# Altium schematic sheet USBULPI.SchDoc
size A4; SheetNumber: 5; SheetTotal: 10
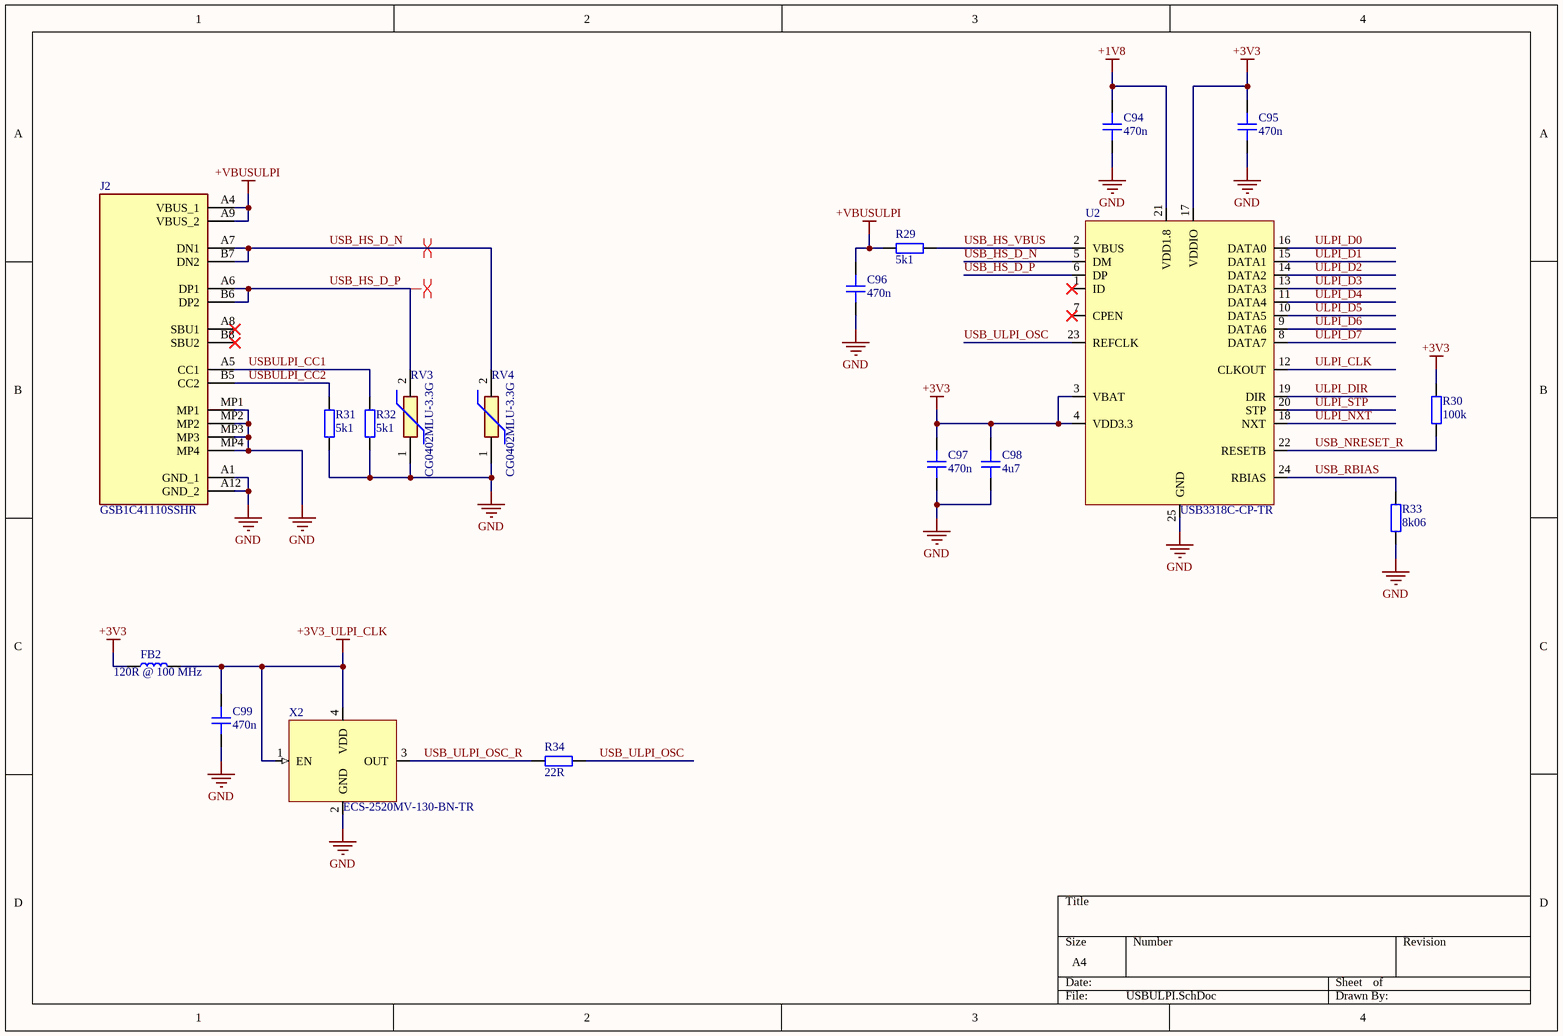
[diagram p0: USBULPI.SchDoc]

## Parts
C94  470n  [CAP_0201]
C95  470n  [CAP_0201]
C96  470n  [CAP_0201]
C97  470n  [CAP_0201]
C98  4u7  [CAP_0402]
C99  470n  [CAP_0201]
FB2  120R @ 100 MHz  [IND_0201]
J2  GSB1C41110SSHR  [GSB1C41110SSHR]
R29  5k1  [RES_0402]
R30  100k  [RES_0402]
R31  5k1  [RES_0402]
R32  5k1  [RES_0402]
R33  8k06  [RES_0402]
R34  22R  [RES_0201]
RV3  CG0402MLU-3.3G  [VARC1005X41N]
RV4  CG0402MLU-3.3G  [VARC1005X41N]
U2  USB3318C-CP-TR  [QFN50P400X400X100-25N-D]
X2  ECS-2520MV-130-BN-TR  [XTAL_2520]

## Nets
+1V8: C94.2 U2.21(VDD1.8)
+3V3: C95.2 C97.2 C98.2 FB2.1 R30.2 U2.3(VBAT) U2.4(VDD3.3) U2.17(VDDIO)
+3V3_ULPI_CLK: C99.2 FB2.2 X2.1(EN) X2.4(VDD)
+VBUSULPI: C96.2 J2.A4(VBUS_1) J2.A9(VBUS_2) R29.2
GND: C94.1 C95.1 C96.1 C97.1 C98.1 C99.1 J2.A1(GND_1) J2.A12(GND_2) J2.MP1 J2.MP2 J2.MP3 J2.MP4 R31.1 R32.1 R33.1 RV3.1 RV4.1 U2.25(GND) X2.2(GND)
ULPI_CLK: U2.12(CLKOUT)
ULPI_D0: U2.16(DATA0)
ULPI_D1: U2.15(DATA1)
ULPI_D2: U2.14(DATA2)
ULPI_D3: U2.13(DATA3)
ULPI_D4: U2.11(DATA4)
ULPI_D5: U2.10(DATA5)
ULPI_D6: U2.9(DATA6)
ULPI_D7: U2.8(DATA7)
ULPI_DIR: U2.19(DIR)
ULPI_NXT: U2.18(NXT)
ULPI_STP: U2.20(STP)
USB_HS_D_N: J2.A7(DN1) J2.B7(DN2) RV4.2 U2.5(DM)
USB_HS_D_P: J2.A6(DP1) J2.B6(DP2) RV3.2 U2.6(DP)
USB_HS_VBUS: R29.1 U2.2(VBUS)
USB_NRESET_R: R30.1 U2.22(RESETB)
USB_RBIAS: R33.2 U2.24(RBIAS)
USB_ULPI_OSC: R34.2 U2.23(REFCLK)
USB_ULPI_OSC_R: R34.1 X2.3(OUT)
USBULPI_CC1: J2.A5(CC1) R32.2
USBULPI_CC2: J2.B5(CC2) R31.2

Not connected (* = marked no-connect by the designer): J2 A8(SBU1)* B8(SBU2)*; U2 1(ID)* 7(CPEN)*

## Layout directives
differential pair: USB_HS_D_N, USB_HS_D_P

## Library data of the parts
C94-C97 C99 = CAP_0201: Capacitor SMD 0201; Manufacturer: *; Manufacturer Part Number: *; Distributor Link: *; LCSC: *; Rating: *; Dielectric: *
C98 = CAP_0402: Capacitor SMD 0402; Manufacturer: *; Manufacturer Part Number: *; Distributor Link: *; LCSC: *; Rating: *; Dielectric: *
FB2 = IND_0201: Inductor SMD 0201; Manufacturer_Name: Murata Electronics; Manufacturer_Part_Number: LQP03HQ56NH02D; Datasheet Link: https://psearch.en.murata.com/inductor/product/LQP03HQ56NH02%23.html; Height: 0.42mm; Mouser Part Number: 81-LQP03HQ56NH02D; Mouser Price/Stock: https://www.mouser.co.uk/ProductDetail/Murata-Electronics/LQP03HQ56NH02D?qs=B6kkDfuK7%2FBQu1Ob9%2FT2Bg%3D%3D
J2 = GSB1C41110SSHR: Connector; Manufacturer_Name: Amphenol Communications Solutions; Datasheet Link: https://cdn.amphenol-cs.com/media/wysiwyg/files/drawing/gsb1c41x10sshr-ax1.pdf; Height: 3.41mm; Manufacturer_Part_Number: GSB1C41110SSHR
R29-R33 = RES_0402: Resistor SMD 0402; Manufacturer: *; Manufacturer Part Number: *; Distributor Link: *; LCSC: *
R34 = RES_0201: Resistor SMD 0201; Manufacturer: *; Manufacturer Part Number: *; Distributor Link: *; LCSC: *
RV3 RV4 = CG0402MLU-3.3G: ESD Diode; Manufacturer_Name: Bourns; Datasheet Link: https://www.bourns.com/docs/Product-Datasheets/MLU.pdf; Height: 0.41mm; Manufacturer_Part_Number: CG0402MLU-3.3G; Mouser Part Number: 652-CG0402MLU-3.3G; Mouser Price/Stock: https://www.mouser.co.uk/ProductDetail/Bourns/CG0402MLU-3.3G?qs=m8myXnDJXpWVM8EQWErxtQ%3D%3D; Arrow Part Number: CG0402MLU-3.3G; Arrow Price/Stock: https://www.arrow.com/en/products/cg0402mlu-3.3g/bourns?utm_currency=USD&region=nac
U2 = USB3318C-CP-TR: USB Interface IC High Speed USB 1.8V ULPI; Manufacturer: Microchip; Manufacturer Part Number: USB3318C-CP-TR
X2 = ECS-2520MV-130-BN-TR: Standard Clock Oscillators XO (Standard),13MHz,Standby (Power Down),CMOS, Multi-Volt,1.6 V 3.6 V,+/-50ppm,-40 C 85 C,6mA,Surface Mount,4-SMD, No Lead,(2.50mm x 2.00mm),(0.80mm); Manufacturer: ECS; Manufacturer Part Number: ECS-2520MV-130-BN-TR